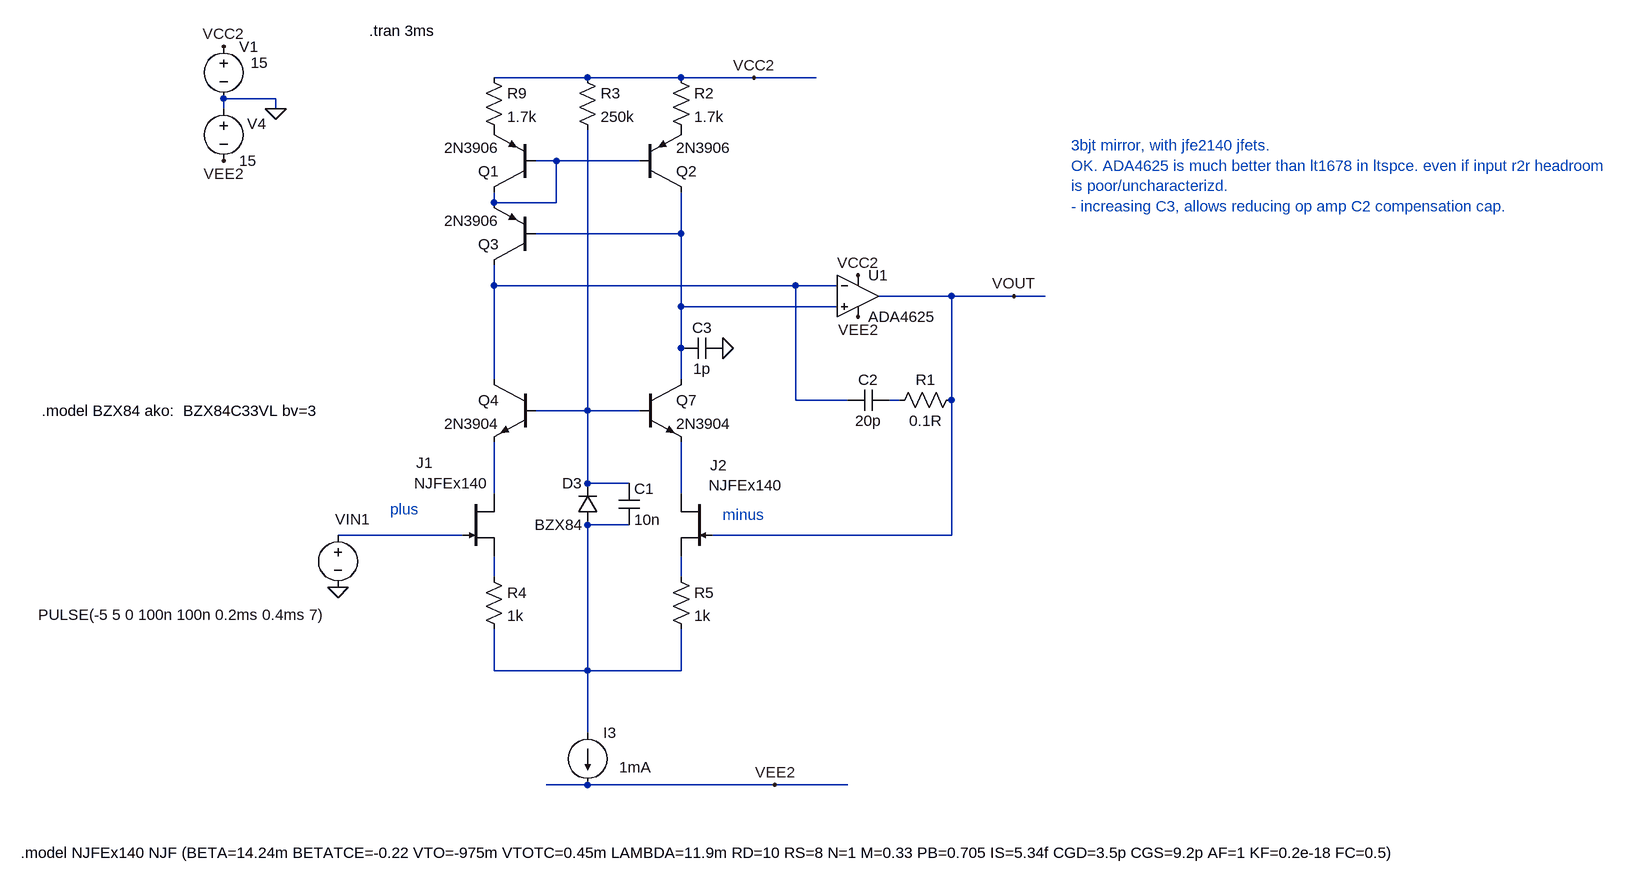
[diagram p0: schematic Draft52.asc]
Draft52.asc, the LTspice schematic file:
Version 4
SHEET 1 2428 952
WIRE 160 -320 16 -320
WIRE 304 -320 160 -320
WIRE 416 -320 304 -320
WIRE 512 -320 416 -320
WIRE -320 -288 -400 -288
WIRE -400 -272 -400 -288
WIRE -320 -272 -320 -288
WIRE 112 -192 80 -192
WIRE 240 -192 112 -192
WIRE 16 -128 16 -144
WIRE 112 -128 112 -192
WIRE 112 -128 16 -128
WIRE 304 -80 304 -144
WIRE 304 -80 80 -80
WIRE 16 0 16 -32
WIRE 480 0 16 0
WIRE 544 0 480 0
WIRE 720 16 608 16
WIRE 816 16 720 16
WIRE 864 16 816 16
WIRE 304 32 304 -80
WIRE 544 32 304 32
WIRE 304 96 304 32
WIRE 16 144 16 0
WIRE 304 144 304 96
WIRE 480 176 480 0
WIRE 560 176 480 176
WIRE 640 176 624 176
WIRE 720 176 720 16
WIRE 160 192 160 -240
WIRE 160 192 80 192
WIRE 240 192 160 192
WIRE 160 304 160 192
WIRE 224 304 160 304
WIRE 16 320 16 240
WIRE 304 320 304 240
WIRE 224 368 160 368
WIRE -32 384 -224 384
WIRE 720 384 720 176
WIRE 720 384 352 384
WIRE 16 448 16 416
WIRE 304 448 304 416
WIRE 16 592 16 528
WIRE 160 592 160 368
WIRE 160 592 16 592
WIRE 304 592 304 528
WIRE 304 592 160 592
WIRE 160 688 160 592
WIRE 160 768 96 768
WIRE 448 768 160 768
WIRE 560 768 448 768
FLAG -320 -272 0
FLAG -400 -368 VCC2
FLAG -400 -192 VEE2
FLAG 416 -320 VCC2
FLAG 448 768 VEE2
FLAG -224 464 0
FLAG 816 16 VOUT
FLAG 576 -16 VCC2
FLAG 576 48 VEE2
FLAG 368 96 0
SYMBOL voltage -400 -384 R0
WINDOW 123 0 0 Left 0
WINDOW 39 0 0 Left 0
WINDOW 3 42 41 Left 2
SYMATTR Value 15
SYMATTR InstName V1
SYMBOL voltage -400 -288 R0
WINDOW 123 0 0 Left 0
WINDOW 39 0 0 Left 0
WINDOW 0 36 39 Left 2
SYMATTR InstName V4
SYMATTR Value 15
SYMBOL voltage -224 368 R0
WINDOW 123 0 0 Left 0
WINDOW 39 0 0 Left 0
WINDOW 3 -461 138 Left 2
WINDOW 0 -4 -9 Left 2
SYMATTR Value PULSE(-5 5 0 100n 100n 0.2ms 0.4ms 7)
SYMATTR InstName VIN1
SYMBOL res 0 -336 R0
SYMATTR InstName R9
SYMATTR Value 1.7k
SYMBOL njf -32 320 R0
WINDOW 0 -72 -48 Left 2
WINDOW 3 -75 -16 Left 2
SYMATTR InstName J1
SYMATTR Value NJFEx140
SYMBOL njf 352 320 M0
WINDOW 0 3 -44 Right 2
WINDOW 3 6 -13 Right 2
SYMATTR InstName J2
SYMATTR Value NJFEx140
SYMBOL current 160 688 R0
WINDOW 123 0 0 Left 0
WINDOW 39 0 0 Left 0
WINDOW 3 49 53 Left 2
SYMATTR Value 1mA
SYMATTR InstName I3
SYMBOL res 288 -336 R0
SYMATTR InstName R2
SYMATTR Value 1.7k
SYMBOL npn 80 144 M0
SYMATTR InstName Q4
SYMATTR Value 2N3904
SYMBOL npn 240 144 R0
SYMATTR InstName Q7
SYMATTR Value 2N3904
SYMBOL diode 176 368 R180
WINDOW 0 24 64 Left 2
WINDOW 3 24 0 Left 2
SYMATTR InstName D3
SYMATTR Value BZX84
SYMBOL cap 208 304 R0
SYMATTR InstName C1
SYMATTR Value 10n
SYMBOL cap 624 160 R90
WINDOW 0 0 32 VBottom 2
WINDOW 3 32 32 VTop 2
SYMATTR InstName C2
SYMATTR Value 20p
SYMBOL res 736 160 R90
WINDOW 0 0 56 VBottom 2
WINDOW 3 32 56 VTop 2
SYMATTR InstName R1
SYMATTR Value 0.1R
SYMBOL res 144 -336 R0
SYMATTR InstName R3
SYMATTR Value 250k
SYMBOL pnp 80 -144 R180
SYMATTR InstName Q1
SYMATTR Value 2N3906
SYMBOL pnp 240 -144 M180
SYMATTR InstName Q2
SYMATTR Value 2N3906
SYMBOL res 0 432 R0
SYMATTR InstName R4
SYMATTR Value 1k
SYMBOL res 288 432 R0
SYMATTR InstName R5
SYMATTR Value 1k
SYMBOL cap 368 80 R90
WINDOW 0 0 32 VBottom 2
WINDOW 3 32 32 VTop 2
SYMATTR InstName C3
SYMATTR Value 1p
SYMBOL pnp 80 -32 R180
SYMATTR InstName Q3
SYMATTR Value 2N3906
SYMBOL OpAmps\\ADA4625 576 -48 R0
SYMATTR InstName U1
TEXT -176 -392 Left 2 !.tran 3ms
TEXT 368 352 Left 2 ;minus
TEXT -144 344 Left 2 ;plus
TEXT -680 192 Left 2 !.model BZX84 ako:  BZX84C33VL bv=3
TEXT 904 -216 Left 2 ;3bjt mirror, with jfe2140 jfets.\nOK. ADA4625 is much better than lt1678 in ltspce. even if input r2r headroom \nis poor/uncharacterizd.\n- increasing C3, allows reducing op amp C2 compensation cap.
TEXT -712 872 Left 2 !.model NJFEx140 NJF (BETA=14.24m BETATCE=-0.22 VTO=-975m VTOTC=0.45m LAMBDA=11.9m RD=10 RS=8 N=1 M=0.33 PB=0.705 IS=5.34f CGD=3.5p CGS=9.2p AF=1 KF=0.2e-18 FC=0.5)

The netlist it stands for:
* Draft52.asc
V1 VCC2 0 15
V4 0 VEE2 15
VIN1 N009 0 PULSE(-5 5 0 100n 100n 0.2ms 0.4ms 7)
R9 VCC2 P001 1.7k
J1 N006 N009 N010 NJFEx140
J2 N007 VOUT N011 NJFEx140
I3 N008 VEE2 1mA
R2 VCC2 P002 1.7k
Q4 N003 N005 N006 0 2N3904
Q7 N002 N005 N007 0 2N3904
D3 N008 N005 BZX84
C1 N005 N008 10n
C2 N004 N003 20p
R1 VOUT N004 0.1R
R3 VCC2 N005 250k
Q1 N001 N001 P001 0 2N3906
Q2 N002 N001 P002 0 2N3906
R4 N010 N008 1k
R5 N011 N008 1k
C3 0 N002 1p
Q3 N003 N002 N001 0 2N3906
XU1 N002 N003 VCC2 VEE2 VOUT ADA4625  ; pins In+ In- V+ V- OUT
.model D D
.lib standard.dio
.model NPN NPN
.model PNP PNP
.lib standard.bjt
.model NJF NJF
.model PJF PJF
.lib standard.jft
.tran 3ms
* minus
* plus
.model BZX84 ako:  BZX84C33VL bv=3
* 3bjt mirror, with jfe2140 jfets.
* OK. ADA4625 is much better than lt1678 in ltspce. even if input r2r headroom
* is poor/uncharacterizd.
* - increasing C3, allows reducing op amp C2 compensation cap.
.model NJFEx140 NJF (BETA=14.24m BETATCE=-0.22 VTO=-975m VTOTC=0.45m LAMBDA=11.9m RD=10 RS=8 N=1 M=0.33 PB=0.705 IS=5.34f CGD=3.5p CGS=9.2p AF=1 KF=0.2e-18 FC=0.5)
.backanno
.end